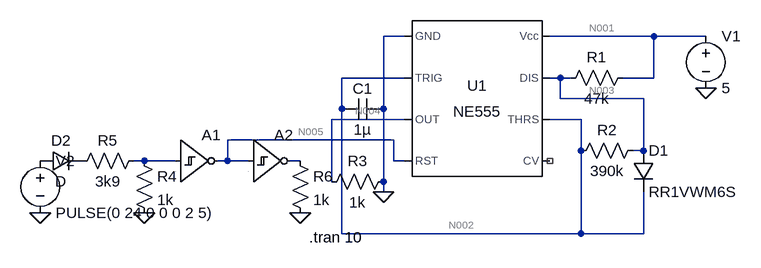
[diagram p0: schematic TSAL.asc]
TSAL.asc, the LTspice schematic file:
Version 4
SHEET 1 880 680
WIRE 64 64 32 64
WIRE 448 64 288 64
WIRE 528 64 448 64
WIRE 64 128 -32 128
WIRE 304 128 288 128
WIRE 320 128 304 128
WIRE 448 128 448 64
WIRE 448 128 400 128
WIRE 304 160 304 128
WIRE 432 160 304 160
WIRE -32 176 -32 128
WIRE 32 176 32 64
WIRE 64 192 -48 192
WIRE 336 192 288 192
WIRE 48 224 -208 224
WIRE 336 240 336 192
WIRE 432 240 432 160
WIRE 432 240 416 240
WIRE -336 256 -352 256
WIRE -288 256 -336 256
WIRE -208 256 -208 224
WIRE -208 256 -224 256
WIRE -176 256 -208 256
WIRE -96 256 -112 256
WIRE 48 256 48 224
WIRE 64 256 48 256
WIRE -48 288 -48 192
WIRE 32 288 32 176
WIRE 32 304 32 288
WIRE -32 368 -32 176
WIRE 336 368 336 240
WIRE 336 368 -32 368
WIRE 432 368 432 304
WIRE 432 368 336 368
FLAG 32 304 0
FLAG 528 144 0
FLAG -496 336 0
FLAG -336 336 0
FLAG -96 336 0
SYMBOL Misc\\NE555 176 160 R0
SYMATTR InstName U1
SYMBOL voltage 528 48 R0
SYMATTR InstName V1
SYMATTR Value 5
SYMBOL res 416 112 R90
WINDOW 0 0 56 VBottom 2
WINDOW 3 32 56 VTop 2
SYMATTR InstName R1
SYMATTR Value 47k
SYMBOL res 432 224 R90
WINDOW 0 0 56 VBottom 2
WINDOW 3 32 56 VTop 2
SYMATTR InstName R2
SYMATTR Value 390k
SYMBOL cap 32 160 R90
WINDOW 0 0 32 VBottom 2
WINDOW 3 32 32 VTop 2
SYMATTR InstName C1
SYMATTR Value 1µ
SYMBOL res 48 272 R90
WINDOW 0 0 56 VBottom 2
WINDOW 3 32 56 VTop 2
SYMATTR InstName R3
SYMATTR Value 1k
SYMBOL diode 416 240 R0
SYMATTR InstName D1
SYMATTR Value RR1VWM6S
SYMBOL voltage -496 240 R0
WINDOW 123 0 0 Left 0
WINDOW 39 0 0 Left 0
SYMATTR InstName V2
SYMATTR Value PULSE(0 24 0 0 0 2 5)
SYMBOL Digital\\schmtinv -288 192 R0
SYMATTR InstName A1
SYMATTR SpiceLine2 Vhigh=5 Vlow=0
SYMBOL Digital\\schmtinv -176 192 R0
SYMATTR InstName A2
SYMATTR SpiceLine2 Vhigh=5 Vlow=0
SYMBOL diode -496 272 R270
WINDOW 0 32 32 VTop 2
WINDOW 3 0 32 VBottom 2
SYMATTR InstName D2
SYMBOL res -352 240 R0
SYMATTR InstName R4
SYMATTR Value 1k
SYMBOL res -336 240 R90
WINDOW 0 0 56 VBottom 2
WINDOW 3 32 56 VTop 2
SYMATTR InstName R5
SYMATTR Value 3k9
SYMBOL res -112 240 R0
SYMATTR InstName R6
SYMATTR Value 1k
TEXT -82 374 Left 2 !.tran 10

The netlist it stands for:
* TSAL.asc
XU1 0 N002 N004 N005 NC_01 N002 N003 N001 NE555  ; pins GND TRIG OUT RST CV THRS DIS Vcc
V1 N001 0 5
R1 N001 N003 47k
R2 N003 N002 390k
C1 0 N002 1µ
R3 0 N004 1k
D1 N003 N002 RR1VWM6S
V2 P001 0 PULSE(0 24 0 0 0 2 5)
A1 N006 0 0 0 0 N005 0 0 SCHMITT Vhigh=5 Vlow=0
A2 N005 0 0 0 0 N007 0 0 SCHMITT Vhigh=5 Vlow=0
D2 P001 P002 D
R4 N006 0 1k
R5 N006 P002 3k9
R6 N007 0 1k
.model D D
.lib standard.dio
.tran 10
.lib NE555.sub
.backanno
.end

* Results of the author's LTspice run, read from the files saved beside the schematic
* Operating Point, zero values left out:
*   V(n002) = 4.995 V
*   V(n001) = 5 V
*   V(n003) = 4.999 V
*   V(n004) = 4.97 V
*   V(n005) = 5 V
*   I(D1) = 220.6 pA
*   I(R3) = -4.97 mA
*   I(R2) = 9.77 nA
*   I(R1) = 16.66 nA
*   I(V1) = -6.558 mA
*   I8(A1) = 22.67 µA
*   I6(A1) = -22.67 µA
*   Ix(u1:1) = -1.611 mA
*   Ix(u1:2) = 4.995 nA
*   Ix(u1:3) = -4.97 mA
*   Ix(u1:4) = 22.67 µA
*   Ix(u1:6) = 4.995 nA
*   Ix(u1:7) = 6.671 nA
*   Ix(u1:8) = 6.558 mA
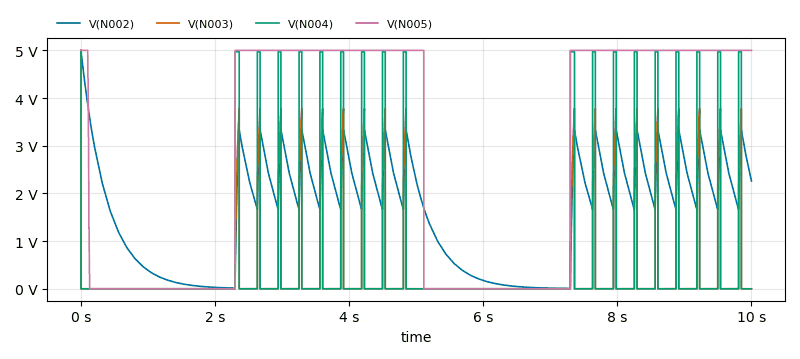
[diagram p1: Transient Analysis of TSAL.asc, plotted from the saved traces]
* Transient Analysis, 1 run:
*   V(N002): min 6.524 mV, max 4.995 V, average 1.61 V, rms 2.007 V, last 2.263 V
*   V(N003): min 638.3 µV, max 4.999 V, average 231.5 mV, rms 846.5 mV, last 673.5 µV
*   V(N004): min 29.82 µV, max 4.972 V, average 386.3 mV, rms 1.386 V, last 29.82 µV
*   V(N005): min 400 µV, max 5 V, average 2.817 V, rms 3.751 V, last 5 V